# Altium schematic sheet POWER.SchDoc
size A4
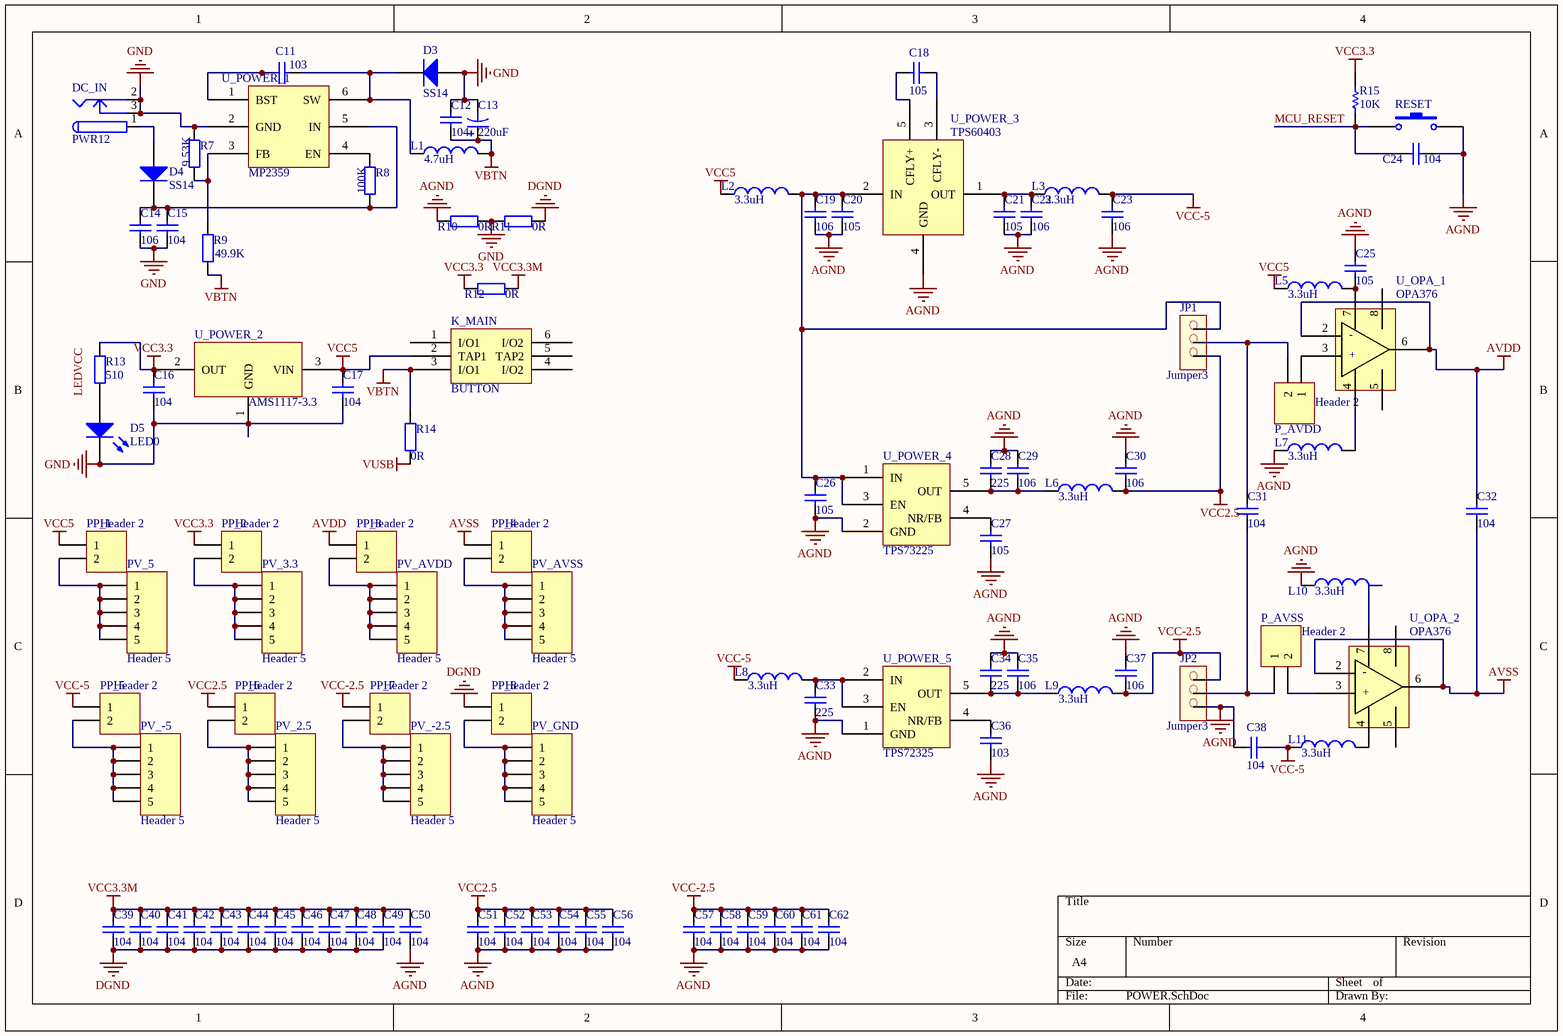
[diagram p0: POWER.SchDoc]

## Parts
C11  value 103  [SMT-0603]  (hidden comment: Cap)
C12  value 104  [SMT-0603]  (hidden comment: Cap)
C13  value 220uF  [SMT-Cap100~220uF(5x5.4)_10V]  (hidden comment: Cap Pol1)
C14  value 106  [SMT-0603]  (hidden comment: Cap)
C15  value 104  [SMT-0603]  (hidden comment: Cap)
C16  value 104  [SMT-0603]  (hidden comment: Cap)
C17  value 104  [SMT-0603]  (hidden comment: Cap)
C18  value 105  [SMT-0603]  (hidden comment: Cap)
C19  value 106  [SMT-0603]  (hidden comment: Cap)
C20  value 105  [SMT-0603]  (hidden comment: Cap)
C21  value 105  [SMT-0603]  (hidden comment: Cap)
C22  value 106  [SMT-0603]  (hidden comment: Cap)
C23  value 106  [SMT-0603]  (hidden comment: Cap)
C24  value 104  [SMT-0603]  (hidden comment: Cap)
C25  value 105  [SMT-0603]  (hidden comment: Cap)
C26  value 105  [SMT-0603]  (hidden comment: Cap)
C27  value 105  [SMT-0603]  (hidden comment: Cap)
C28  value 225  [SMT-0603]  (hidden comment: Cap)
C29  value 106  [SMT-0603]  (hidden comment: Cap)
C30  value 106  [SMT-0603]  (hidden comment: Cap)
C31  value 104  [SMT-0603]  (hidden comment: Cap)
C32  value 104  [SMT-0603]  (hidden comment: Cap)
C33  value 225  [SMT-0603]  (hidden comment: Cap)
C34  value 225  [SMT-0603]  (hidden comment: Cap)
C35  value 106  [SMT-0603]  (hidden comment: Cap)
C36  value 103  [SMT-0603]  (hidden comment: Cap)
C37  value 106  [SMT-0603]  (hidden comment: Cap)
C38  value 104  [SMT-0603]  (hidden comment: Cap)
C39  value 104  [SMT-0603]  (hidden comment: Cap)
C40  value 104  [SMT-0603]  (hidden comment: Cap)
C41  value 104  [SMT-0603]  (hidden comment: Cap)
C42  value 104  [SMT-0603]  (hidden comment: Cap)
C43  value 104  [SMT-0603]  (hidden comment: Cap)
C44  value 104  [SMT-0603]  (hidden comment: Cap)
C45  value 104  [SMT-0603]  (hidden comment: Cap)
C46  value 104  [SMT-0603]  (hidden comment: Cap)
C47  value 104  [SMT-0603]  (hidden comment: Cap)
C48  value 104  [SMT-0603]  (hidden comment: Cap)
C49  value 104  [SMT-0603]  (hidden comment: Cap)
C50  value 104  [SMT-0603]  (hidden comment: Cap)
C51  value 104  [SMT-0603]  (hidden comment: Cap)
C52  value 104  [SMT-0603]  (hidden comment: Cap)
C53  value 104  [SMT-0603]  (hidden comment: Cap)
C54  value 104  [SMT-0603]  (hidden comment: Cap)
C55  value 104  [SMT-0603]  (hidden comment: Cap)
C56  value 104  [SMT-0603]  (hidden comment: Cap)
C57  value 104  [SMT-0603]  (hidden comment: Cap)
C58  value 104  [SMT-0603]  (hidden comment: Cap)
C59  value 104  [SMT-0603]  (hidden comment: Cap)
C60  value 104  [SMT-0603]  (hidden comment: Cap)
C61  value 104  [SMT-0603]  (hidden comment: Cap)
C62  value 104  [SMT-0603]  (hidden comment: Cap)
D3  SS14  [SMA]
D4  SS14  [SMA]
D5  LED0  [K3528]
DC_IN  PWR12  [D-DCJACK]
JP1  Jumper3  [HDR1X3]
JP2  Jumper3  [HDR1X3]
K_MAIN  BUTTON  [Auto_lock_SW_7X7]
L1  value 4.7uH  [SMT-0805]  (hidden comment: Inductor)
L2  value 3.3uH  [SMT-0805]  (hidden comment: Inductor)
L3  value 3.3uH  [SMT-0805]  (hidden comment: Inductor)
L5  value 3.3uH  [SMT-0805]  (hidden comment: Inductor)
L6  value 3.3uH  [SMT-0805]  (hidden comment: Inductor)
L7  value 3.3uH  [SMT-0805]  (hidden comment: Inductor)
L8  value 3.3uH  [SMT-0805]  (hidden comment: Inductor)
L9  value 3.3uH  [SMT-0805]  (hidden comment: Inductor)
L10  value 3.3uH  [SMT-0805]  (hidden comment: Inductor)
L11  value 3.3uH  [SMT-0805]  (hidden comment: Inductor)
P_AVDD  Header 2  [HDR1X2]
P_AVSS  Header 2  [HDR1X2]
PP_1  Header 2  [HDR1X2]
PP_2  Header 2  [HDR1X2]
PP_3  Header 2  [HDR1X2]
PP_4  Header 2  [HDR1X2]
PP_5  Header 2  [HDR1X2]
PP_6  Header 2  [HDR1X2]
PP_7  Header 2  [HDR1X2]
PP_8  Header 2  [HDR1X2]
PV_2.5  Header 5  [HDR1X5]
PV_3.3  Header 5  [HDR1X5]
PV_5  Header 5  [HDR1X5]
PV_-2.5  Header 5  [HDR1X5]
PV_-5  Header 5  [HDR1X5]
PV_AVDD  Header 5  [HDR1X5]
PV_AVSS  Header 5  [HDR1X5]
PV_GND  Header 5  [HDR1X5]
R7  9.53K  [SMT-0603]
R8  value 100K  [SMT-0603]  (hidden comment: 9.53K)
R9  value 49.9K  [SMT-0603]  (hidden comment: Res2)
R10  0R  [SMT-0603]
R11  0R  [SMT-0603]
R12  0R  [SMT-0603]
R13  value 510  [SMT-0603]  (hidden comment: Res2)
R14  0R  [SMT-0603]
R15  value 10K  [SMT-0603]  (hidden comment: Res1)
RESET  W-PB  [SW-DEMO_1]  (value not drawn)
U_OPA_1  OPA376  [SOP8]
U_OPA_2  OPA376  [SOP8]
U_POWER_1  MP2359  [SOT-23-6]
U_POWER_2  AMS1117-3.3  [SOT223]
U_POWER_3  TPS60403
U_POWER_4  TPS73225
U_POWER_5  TPS72325

## Nets
AGND: C19.1 C20.1 C21.1 C22.1 C23.1 C24.2 C25.2 C26.1 C27.1 C28.2 C29.2 C30.2 C33.1 C34.2 C35.2 C36.1 C37.2 C38.1 C50.1 C51.1 C52.1 C53.1 C54.1 C55.1 C56.1 C57.1 C58.1 C59.1 C60.1 C61.1 C62.1 JP2.1 L7.1 L10.1 R10.1 RESET.2 U_POWER_3.4(GND) U_POWER_4.2(GND) U_POWER_5.1(GND)
AVDD: C32.2 PP_3.1 U_OPA_1.2 U_OPA_1.6
AVSS: C32.1 PP_4.1 U_OPA_2.2 U_OPA_2.6
DGND: C39.1 C40.1 C41.1 C42.1 C43.1 C44.1 C45.1 C46.1 C47.1 C48.1 C49.1 PP_8.1 R11.2
GND: C12.2 C13.2 C14.2 C15.2 C16.1 C17.1 D3.1(A) D5.2(K) DC_IN.2 DC_IN.3 R7.2 R10.2 R11.1 U_POWER_1.2(GND) U_POWER_2.1(GND)
VBTN: C12.1 C13.1 K_MAIN.3(I/O1) L1.2 R9.1 R14.2
VCC2.5: C30.1 C51.2 C52.2 C53.2 C54.2 C55.2 C56.2 JP1.1 L6.2 PP_6.1
VCC3.3: C16.2 PP_2.1 R12.1 R13.2 R15.2 U_POWER_2.2(OUT)
VCC3.3M: C39.2 C40.2 C41.2 C42.2 C43.2 C44.2 C45.2 C46.2 C47.2 C48.2 C49.2 C50.2 R12.2
VCC5: C17.2 K_MAIN.2(TAP1) L2.1 L5.1 PP_1.1 U_POWER_2.3(VIN)
VCC-2.5: C37.1 C57.2 C58.2 C59.2 C60.2 C61.2 C62.2 JP2.3 L9.2 PP_7.1
VCC-5: C23.2 C38.2 L3.2 L8.1 L11.1 PP_5.1
VUSB: R14.1
MCU_RESET: C24.1 R15.1 RESET.1
NetC11_1: C11.1 D3.2(K) L1.1 U_POWER_1.6(SW)
NetC11_2: C11.2 U_POWER_1.1(BST)
NetC14_1: C14.1 C15.1 D4.2(K) R8.1 U_POWER_1.5(IN)
NetC18_1: C18.1 U_POWER_3.5(CFLY+)
NetC18_2: C18.2 U_POWER_3.3(CFLY-)
NetC19_2: C19.2 C20.2 C26.2 JP1.3 L2.2 U_POWER_3.2(IN) U_POWER_4.1(IN) U_POWER_4.3(EN)
NetC21_2: C21.2 C22.2 L3.1 U_POWER_3.1(OUT)
NetC25_1: C25.1 L5.2 U_OPA_1.7
NetC27_2: C27.2 U_POWER_4.4(NR/FB)
NetC28_1: C28.1 C29.1 L6.1 U_POWER_4.5(OUT)
NetC31_1: C31.1 JP2.2 P_AVSS.1
NetC31_2: C31.2 JP1.2 P_AVDD.2
NetC33_2: C33.2 L8.2 U_POWER_5.2(IN) U_POWER_5.3(EN)
NetC34_1: C34.1 C35.1 L9.1 U_POWER_5.5(OUT)
NetC36_2: C36.2 U_POWER_5.4(NR/FB)
NetD4_1: D4.1(A) DC_IN.1
NetD5_1: D5.1(A) R13.1
NetL7_2: L7.2 U_OPA_1.4
NetL10_2: L10.2 U_OPA_2.7
NetL11_2: L11.2 U_OPA_2.4
NetP_AVDD_1: P_AVDD.1 U_OPA_1.3
NetP_AVSS_2: P_AVSS.2 U_OPA_2.3
NetPP_1_2: PP_1.2 PV_5.1 PV_5.2 PV_5.3 PV_5.4 PV_5.5
NetPP_2_2: PP_2.2 PV_3.3.1 PV_3.3.2 PV_3.3.3 PV_3.3.4 PV_3.3.5
NetPP_3_2: PP_3.2 PV_AVDD.1 PV_AVDD.2 PV_AVDD.3 PV_AVDD.4 PV_AVDD.5
NetPP_4_2: PP_4.2 PV_AVSS.1 PV_AVSS.2 PV_AVSS.3 PV_AVSS.4 PV_AVSS.5
NetPP_5_2: PP_5.2 PV_-5.1 PV_-5.2 PV_-5.3 PV_-5.4 PV_-5.5
NetPP_6_2: PP_6.2 PV_2.5.1 PV_2.5.2 PV_2.5.3 PV_2.5.4 PV_2.5.5
NetPP_7_2: PP_7.2 PV_-2.5.1 PV_-2.5.2 PV_-2.5.3 PV_-2.5.4 PV_-2.5.5
NetPP_8_2: PP_8.2 PV_GND.1 PV_GND.2 PV_GND.3 PV_GND.4 PV_GND.5
NetR7_1: R7.1 R9.2 U_POWER_1.3(FB)
NetR8_2: R8.2 U_POWER_1.4(EN)

Not connected (* = marked no-connect by the designer): K_MAIN 1(I/O1) 4(I/O2) 5(TAP2) 6(I/O2); U_OPA_1 5 8; U_OPA_2 5 8

## Notes on the sheet
- Labels drawn without touching a wire or pin: LEDVCC
- (in symbol OPA376) -; +

## Library data of the parts
C11 C12 C14-C62 = Cap: Capacitor; Published: 8-Jun-2000; LatestRevisionDate: 17-Jul-2002; LatestRevisionNote: Re-released for DXP Platform.; PackageReference: RAD-0.3; Publisher: Altium Limited; PackageDescription: Radial Cap, Thru-Hole; 2 Leads; 0.3 in Pin Spacing
C13 = Cap Pol1: Polarized Capacitor (Radial); Published: 8-Jun-2000; LatestRevisionDate: 17-Jul-2002; LatestRevisionNote: Re-released for DXP Platform.; PackageReference: RB7.6-15; Publisher: Altium Limited; PackageDescription: Polarized Capacitor (Radial); 2 Leads
D3 D4 = Diode 1N5400: 3 Amp General Purpose Rectifier; Published: 8-Jun-2000; LatestRevisionDate: 17-Jul-2002; LatestRevisionNote: Re-released for DXP Platform.; DatasheetVersion: 1998; PackageVersion: Aug-1999; PackageReference: DO-201AD; Publisher: Altium Limited; PackageDescription: Diode, Axial; Body 9.5 x 5.6 mm (LxDia. max), Lead Dia. 1.32 mm (max); ComponentLink1Description: Manufacturer Link; ComponentLink1URL: http://www.fairchildsemi.com/; ComponentLink2Description: Datasheet; ComponentLink2URL: http://www.fairchildsemi.com/ds/1N%2F1N5400.pdf
D5 = LED0: Typical INFRARED GaAs LED; Published: 8-Jun-2000; Revision: July-2002: Re-released for DXP Platform.; Publisher: Altium Limited
DC_IN = PWR2.5: Low Voltage Power Supply Connector; Published: 17-Dec-2003; DatasheetDocument: 09-May-2002; Publisher: Altium Limited; ComponentLink1Description: Manufacturer Link; ComponentLink1URL: http://domino.kycon.com/internet/Products.html
L1-L3 L5-L11 = Inductor: Code_IEC: 1005; Published: 8-Jun-2000; LatestRevisionDate: 29-May-2009; LatestRevisionNote: IPC-7351 Footprint Added.; PackageReference: 0402-A; Publisher: Altium Limited; PackageDescription: Chip Inductor; Code_JEITA: 0402
P_AVDD P_AVSS PP_1-PP_8 = Header 2: Header, 2-Pin; LatestRevisionDate: 17-Jul-2002; LatestRevisionNote: Re-released for DXP Platform.; Publisher: Altium Limited
PV_2.5 PV_3.3 PV_5 PV_-2.5 PV_-5 PV_AVDD PV_AVSS PV_GND = Header 5: Header, 5-Pin; LatestRevisionDate: 17-Jul-2002; LatestRevisionNote: Re-released for DXP Platform.; Publisher: Altium Limited
R7-R14 = Res2: Resistor; Published: 8-Jun-2000; LatestRevisionDate: 17-Jul-2002; LatestRevisionNote: Re-released for DXP Platform.; PackageReference: AXIAL-0.4; Publisher: Altium Limited; PackageDescription: Axial Device, Thru-Hole; 2 Leads; 0.4 in Pin Spacing
  R7: Value: 9.53K
  R10-R12 R14: Value: 0R
R15 = Res1: Resistor; Published: 8-Jun-2000; LatestRevisionDate: 17-Jul-2002; LatestRevisionNote: Re-released for DXP Platform.; PackageReference: AXIAL-0.3; Publisher: Altium Limited; PackageDescription: Axial Device, Thru-Hole; 2 Leads; 0.3 in Pin Spacing
RESET = SW-PB: Switch; Published: 24-Mar-1999; LatestRevisionDate: 17-Jul-2002; LatestRevisionNote: Re-released for DXP Platform.; PackageReference: SPST-2; Publisher: Altium Limited; PackageDescription: Switch; 2 Leads
U_POWER_2 = AMS1117